# EAGLE design main_module (EAGLE 9.6.2)

## Sheet 1 of 2
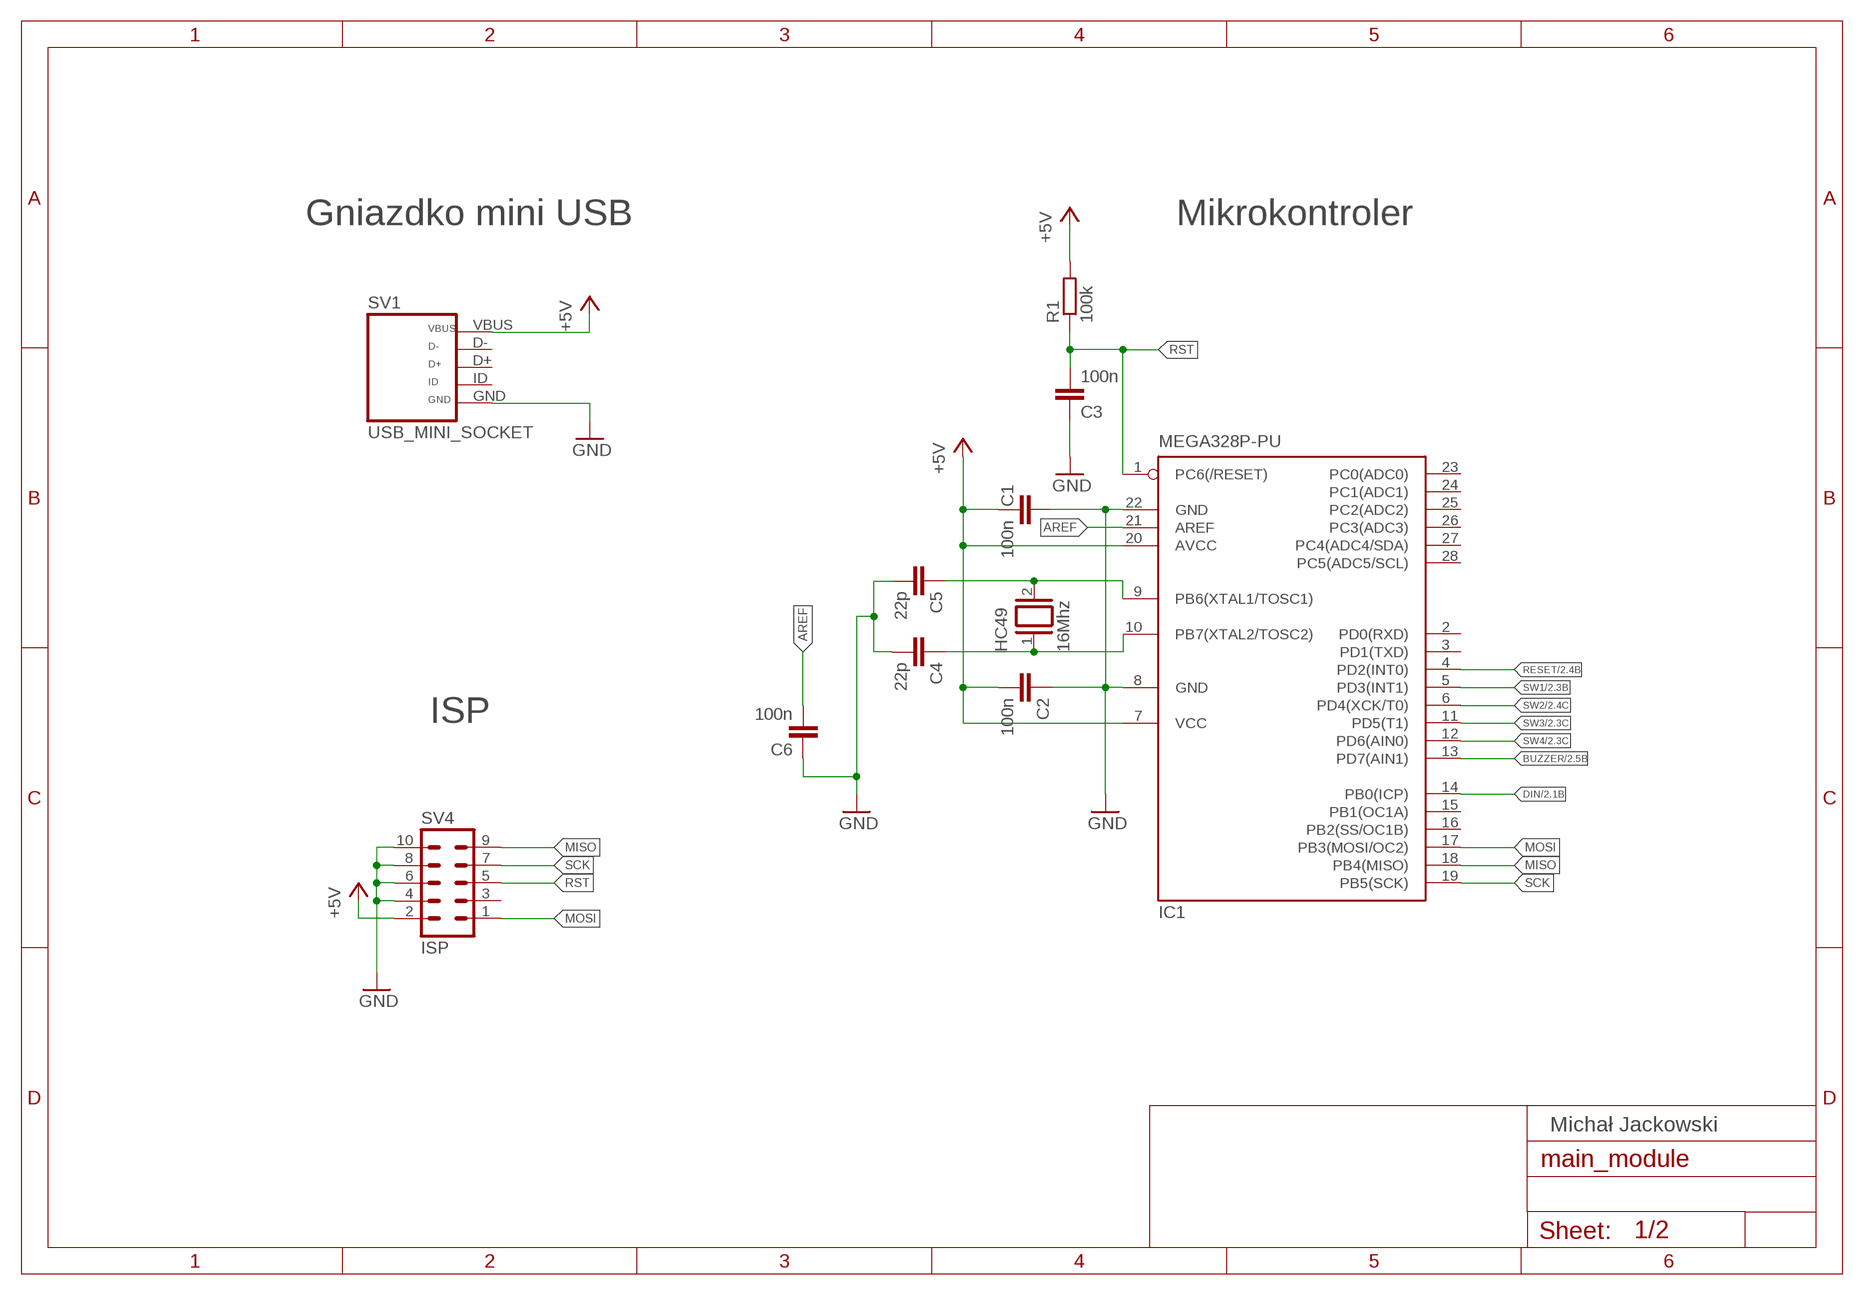
[diagram p0: schematic, sheet 1]

### Parts
C1  100n  C-EU025-040X050  [C025-040X050]
C2  100n  C-EU025-040X050  [C025-040X050]
C3  100n  C-EU025-040X050  [C025-040X050]
C4  22p  C-EU025-040X050  [C025-040X050]
C5  22p  C-EU025-040X050  [C025-040X050]
C6  100n  C-EU025-040X050  [C025-040X050]
IC1  MEGA328P-PU  [DIL28-3]
Q1  16Mhz  XTAL  [Q]
R1  100k  R-EU_0204/7  [0204/7]
SV1  USB_MINI_SOCKET  USB_MINI_SOCKETGNIAZDO5PINFE  [FE05-1]
SV4  ISP  ML10L  [ML10L]

### Nets
+5V: C1.2 C2.2 IC1.7(VCC) IC1.20(AVCC) R1.2 SV1.VBUS SV4.2 ; also sheet 2
AREF: C6.2 IC1.21(AREF)
BUZZER: IC1.13(PD7(AIN1)) ; also sheet 2
DIN: IC1.14(PB0(ICP)) ; also sheet 2
GND: C1.1 C2.1 C3.1 C4.2 C5.2 C6.1 IC1.8(GND) IC1.22(GND) SV1.GND SV4.4 SV4.6 SV4.8 SV4.10 ; also sheet 2
MISO: IC1.18(PB4(MISO)) SV4.9
MOSI: IC1.17(PB3(MOSI/OC2)) SV4.1
N$1: C5.1 IC1.9(PB6(XTAL1/TOSC1)) Q1.2
N$2: C4.1 IC1.10(PB7(XTAL2/TOSC2)) Q1.1
RESET: IC1.4(PD2(INT0)) ; also sheet 2
RST: C3.2 IC1.1(PC6(/RESET)) R1.1 SV4.5
SCK: IC1.19(PB5(SCK)) SV4.7
SW1: IC1.5(PD3(INT1)) ; also sheet 2
SW2: IC1.6(PD4(XCK/T0)) ; also sheet 2
SW3: IC1.11(PD5(T1)) ; also sheet 2
SW4: IC1.12(PD6(AIN0)) ; also sheet 2
Unconnected: IC1.2(PD0(RXD)) IC1.3(PD1(TXD)) IC1.15(PB1(OC1A)) IC1.16(PB2(SS/OC1B)) IC1.23(PC0(ADC0)) IC1.24(PC1(ADC1)) IC1.25(PC2(ADC2)) IC1.26(PC3(ADC3)) IC1.27(PC4(ADC4/SDA)) IC1.28(PC5(ADC5/SCL)) SV1.D+ SV1.D- SV1.ID SV4.3

### Notes on the sheet
- Gniazdko mini USB | Mikrokontroler
- ISP
- Michał Jackowski

## Sheet 2 of 2
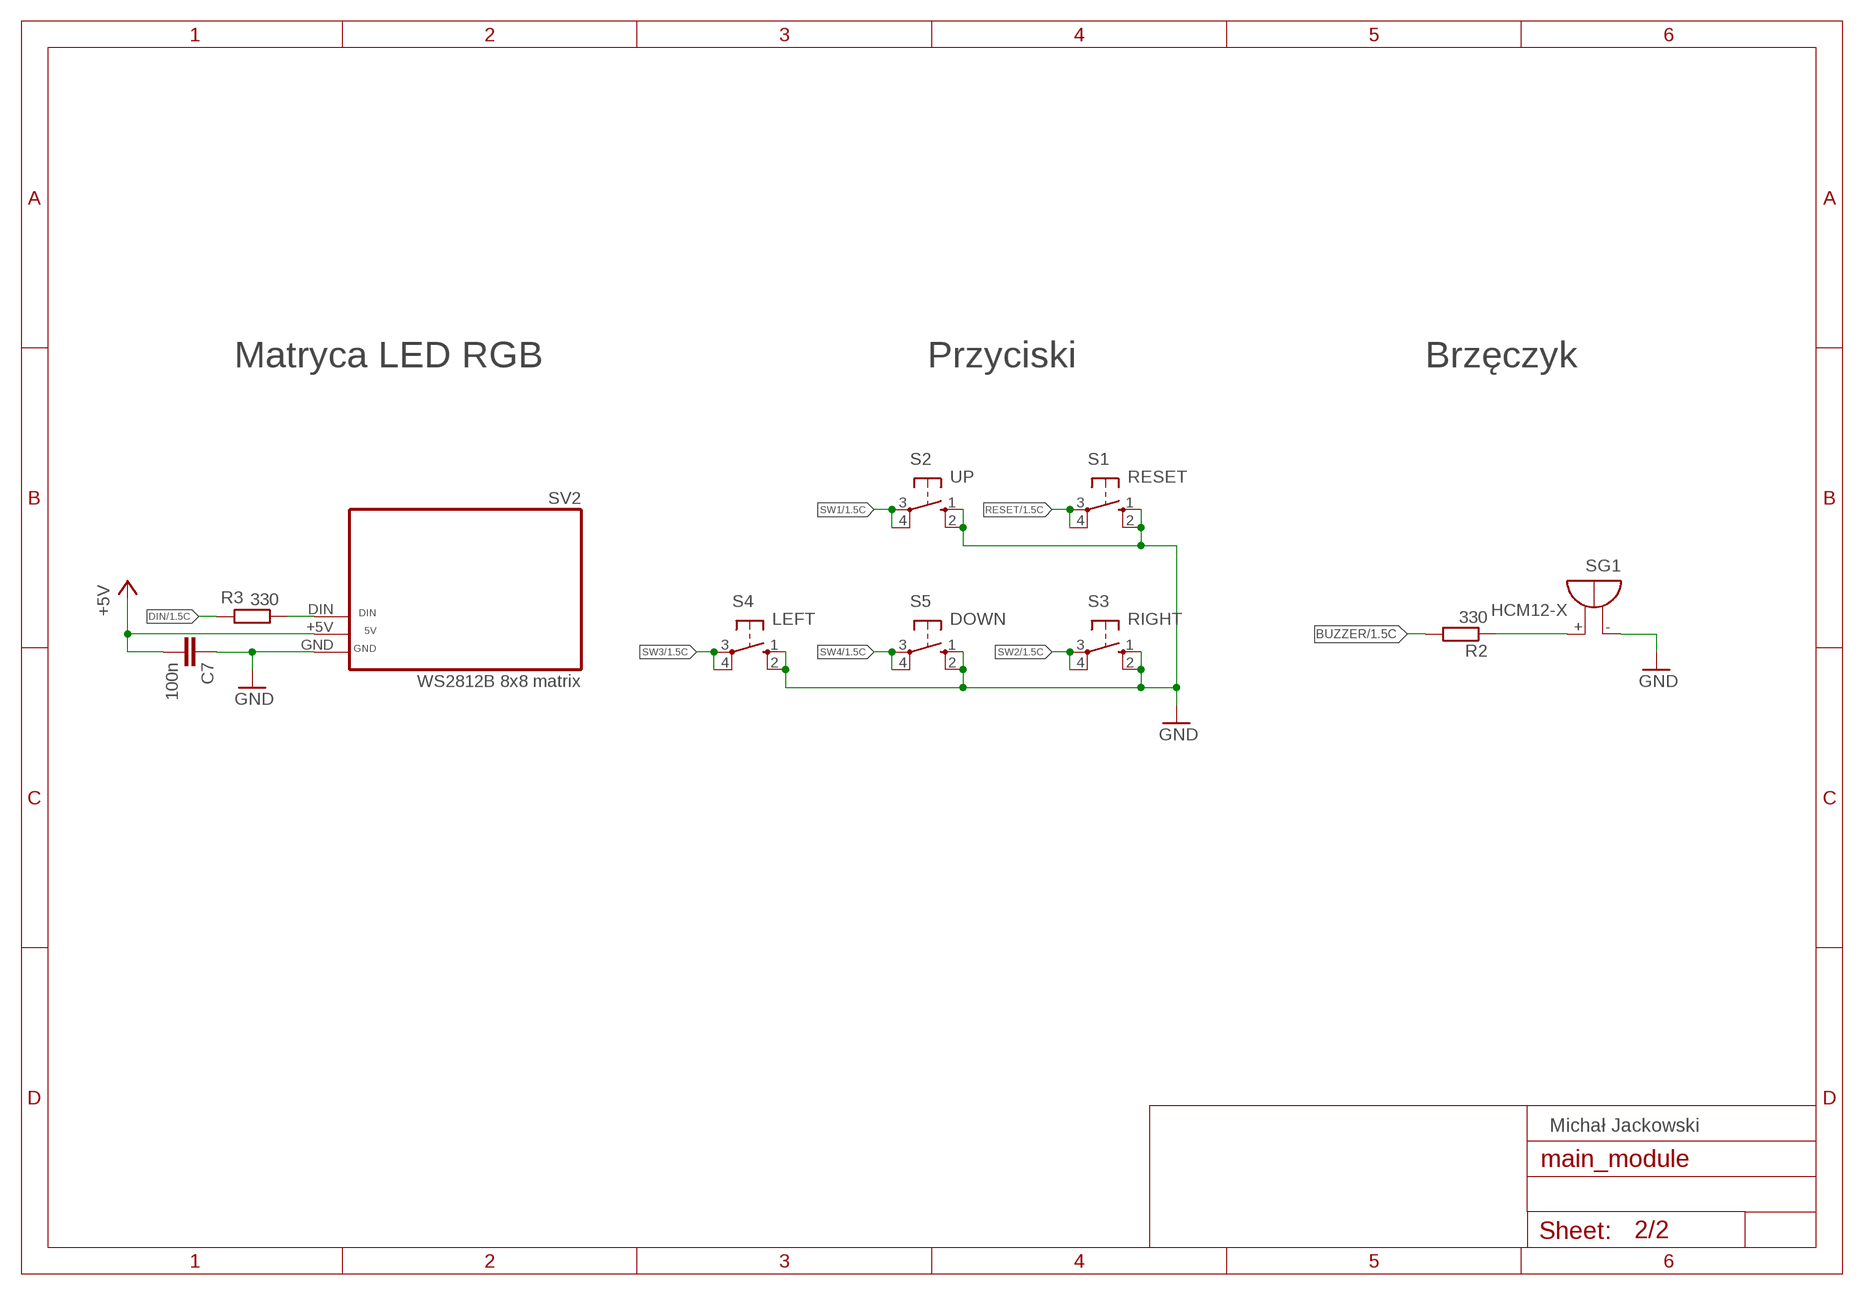
[diagram p1: schematic, sheet 2]

### Parts
C7  100n  C-EU025-040X050  [C025-040X050]
R2  330  R-EU_0204/7  [0204/7]
R3  330  R-EU_0204/7  [0204/7]
S1  RESET  40-XX  [B3F-40XX]
S2  UP  40-XX  [B3F-40XX]
S3  RIGHT  40-XX  [B3F-40XX]
S4  LEFT  40-XX  [B3F-40XX]
S5  DOWN  40-XX  [B3F-40XX]
SG1  HCM12-X  [F/QMBIII]
SV2  RGB_MATRIX_SOCKET  RGB_MATRIX_CONNECTOR  [MA03-1]

### Nets
+5V: C7.2 SV2.+5V(5V) ; also sheet 1
BUZZER: R2.2 ; also sheet 1
DIN: R3.2 ; also sheet 1
GND: C7.1 S1.1(S) S1.2(S1) S2.1(S) S2.2(S1) S3.1(S) S3.2(S1) S4.1(S) S4.2(S1) S5.1(S) S5.2(S1) SG1.-(+) SV2.GND ; also sheet 1
N$3: R2.1 SG1.+(-)
N$4: R3.1 SV2.DIN
RESET: S1.3(P) S1.4(P1) ; also sheet 1
SW1: S2.3(P) S2.4(P1) ; also sheet 1
SW2: S3.3(P) S3.4(P1) ; also sheet 1
SW3: S4.3(P) S4.4(P1) ; also sheet 1
SW4: S5.3(P) S5.4(P1) ; also sheet 1

### Notes on the sheet
- Matryca LED RGB | Przyciski | Brzęczyk
- Michał Jackowski

## Library data of the parts
C1-C7 = rcl:C-EU: CAPACITOR, European symbol; SPICEPREFIX: C
IC1 = Snake:MEGA328P-PU: MICROCONTROLLER 8 Kbytes FLASH, 1 kbytes SRAM, 512 bytes EEPROM, USART, 4-channel 10 bit ADC, 2-channel 8 bit ADC Pin compatible with Atmega48, ATMega88, ATMega168 Source: avr.lbr; OC_FARNELL: unknown; OC_NEWARK: unknown
Q1 = Snake:XTAL: CRYSTAL
R1-R3 = rcl:R-EU_: RESISTOR, European symbol; SPICEPREFIX: R
S1-S5 = Snake:40-XX: OMRON SWITCH; MF: OMRON COMPONENTS USA; MPN: B3F-4000; OC_FARNELL: 176434; OC_NEWARK: 36K3105
SG1 = Snake:HCM12-X: BUZZER Source: Buerklin; OC_FARNELL: unknown; OC_NEWARK: unknown
SV1 = Snake:USB_MINI_SOCKET: FEMALE HEADER
SV2 = Snake:RGB_MATRIX_CONNECTOR: PIN HEADER; OC_FARNELL: unknown; OC_NEWARK: unknown
SV4 = con-harting-ml:ML10: HARTING; OC_FARNELL: unknown; OC_NEWARK: unknown

## Board
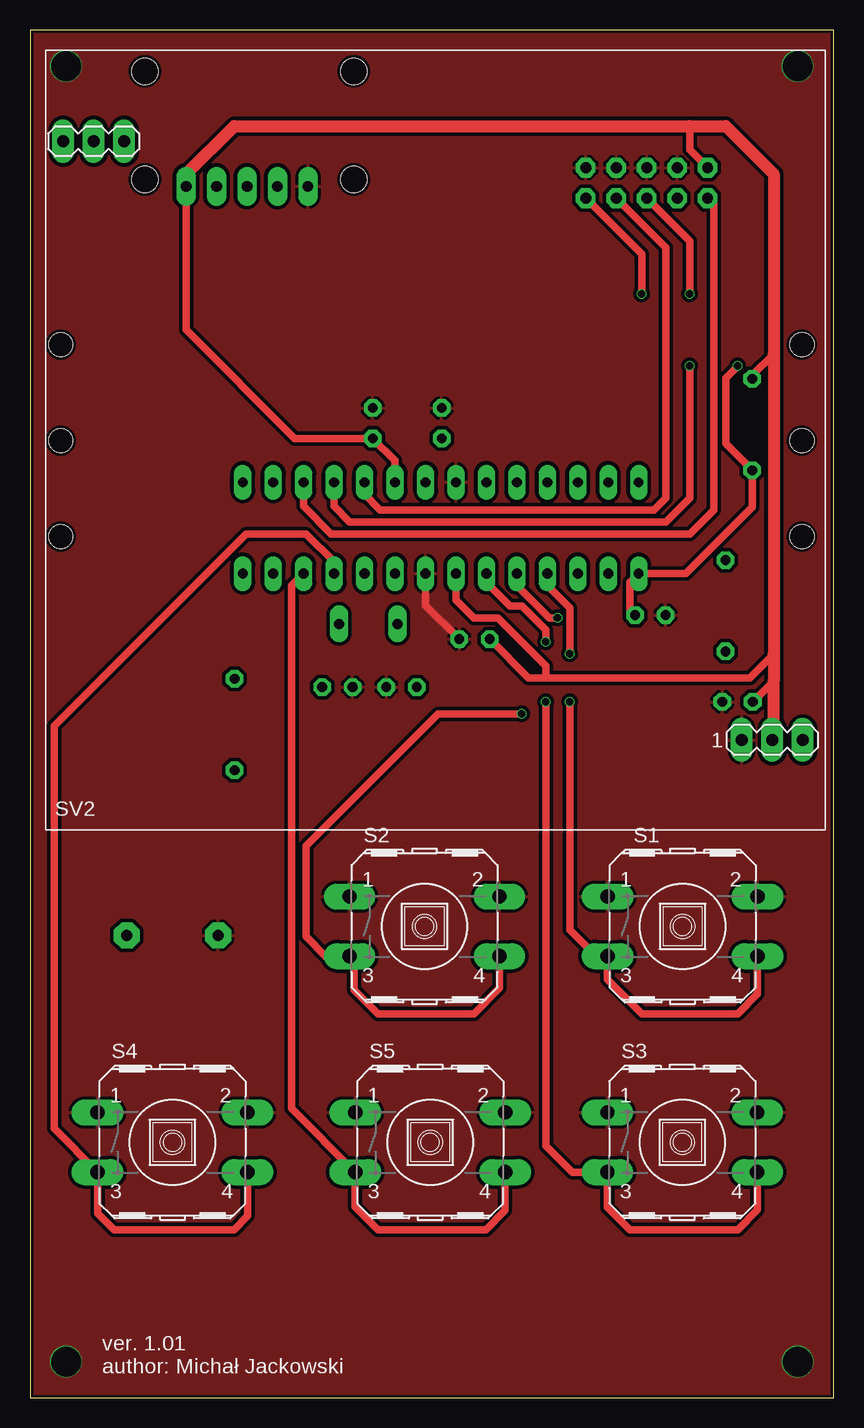
[diagram p2: board, top side]
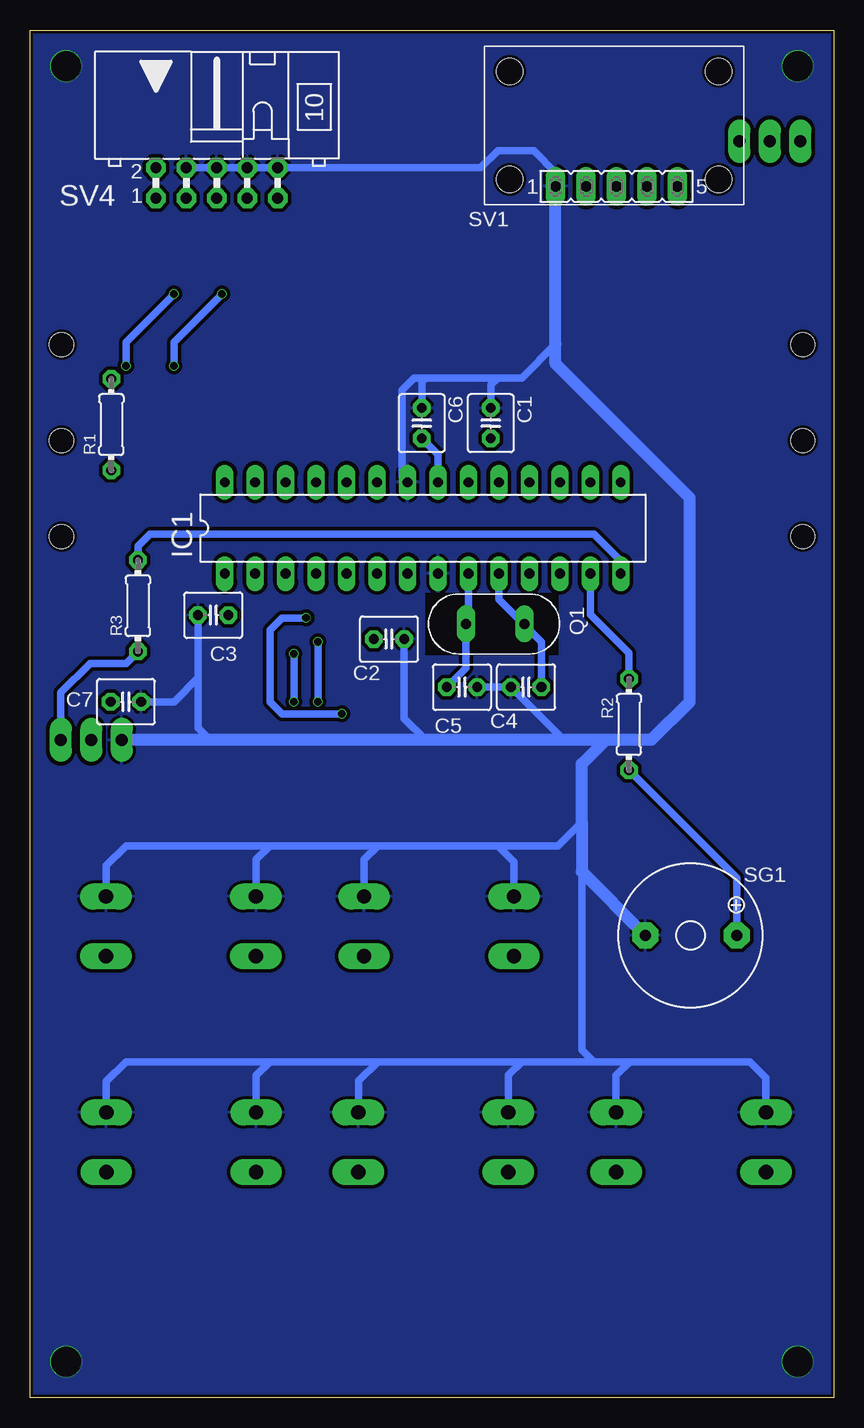
[diagram p3: board, bottom side, seen from below]

Size 67 x 114 mm. Coordinates in mm from the lower left corner, seen from the top.
Outline: 0,0 67,0 67,114 0,114 0,0
Copper layers (1*16): Top 0.035mm / dielectric 1.6mm / Bottom 0.035mm
Design rules "jlcpcb-2layers *": minimum track width 5mil, minimum drill 0.3mm, track to track 12mil, track to pad 12mil, pad to pad 12mil, via to via 12mil, smd to smd 12mil, copper to edge 0.2mm, drill to drill 6mil, minimum pad ring 10mil, minimum via ring 3mil, stop-mask expansion 4mil, vias tented up to drill 0mil, thermal gap 10mil

### Footprints (pad centres in the part's own frame; a part is rotated, then mirrored left to right if it is on the bottom)
C025-040X050 = drill 0.813 octagon: 1 -1.27,0; 2 1.27,0
DIL28-3 = drill 0.813 long: 1 -16.51,-3.81; 2 -13.97,-3.81; 3 -11.43,-3.81; 4 -8.89,-3.81; 5 -6.35,-3.81; 6 -3.81,-3.81; 7 -1.27,-3.81; 8 1.27,-3.81; 9 3.81,-3.81; 10 6.35,-3.81; 11 8.89,-3.81; 12 11.43,-3.81; 13 13.97,-3.81; 14 16.51,-3.81; 15 16.51,3.81; 16 13.97,3.81; 17 11.43,3.81; 18 8.89,3.81; 19 6.35,3.81; 20 3.81,3.81; 21 1.27,3.81; 22 -1.27,3.81; 23 -3.81,3.81; 24 -6.35,3.81; 25 -8.89,3.81; 26 -11.43,3.81; 27 -13.97,3.81; 28 -16.51,3.81
Q = drill 0.85 long: 1 0,0; 2 4.88,0
0204/7 = drill 0.813 octagon: 1 -3.81,0; 2 3.81,0
B3F-40XX = drill 1.194 long: 1 -6.248,2.489; 2 6.248,2.489; 3 -6.248,-2.489; 4 6.248,-2.489
F/QMBIII = drill 0.914 pad 2.159 octagon: + 3.851,0; - -3.751,0
FE05-1 = drill 0.9 long: D+ 10.998,1.524; D- 13.538,1.524; GND 5.918,1.524; ID 8.458,1.524; VBUS 16.078,1.524 | hole 2.184: 2.092,2.092; 2.092,11.116; 19.498,11.116; 19.498,2.092
MA03-1 = drill 1.016 long: +5V 60.62,7.55; +5VOUT 4.04,57.46; DIN 63.16,7.55; DOUT 1.5,57.46; GND 58.08,7.55; GNDOUT 6.58,57.46 | hole 2: 1.3,32.5; 63.1,32.5; 63.1,24.5; 63.1,40.5; 1.3,40.5; 1.3,24.5
ML10L = drill 0.914 octagon: 1 -5.08,-1.27; 2 -5.08,1.27; 3 -2.54,-1.27; 4 -2.54,1.27; 5 0,-1.27; 6 0,1.27; 7 2.54,-1.27; 8 2.54,1.27; 9 5.08,-1.27; 10 5.08,1.27

### Placement (x,y rotation side)
C1  28.58,81.22 270 bottom
C2  37.07,63.22 180 bottom
C3  51.72,65.22 0 bottom
C4  25.63,59.22 180 bottom
C5  30.98,59.22 0 bottom
C6  34.33,81.22 270 bottom
C7  59,58 180 bottom
IC1  34.25,72.49 0 bottom
Q1  25.77,64.49 180 bottom
R1  60.22,81.11 90 bottom
R2  17.06,56.11 90 bottom
R3  58,66 90 bottom
S1  54.41,39.28 0 top
S2  32.9,39.28 0 top
S3  54.39,21.28 0 top
S4  11.88,21.28 0 top
S5  33.37,21.28 0 top
SG1  11.93,38.52 0 bottom
SV1  29.09,99.44 0 bottom
SV2  1.27,47.27 0 top
SV4  51.42,101.25 0 bottom

### Tracks (layer width: path | path; a pad name or v marks a point on that pad's centre or on a via)
+5V
  Top 0.61: SV1.VBUS 13.01,89.01 22.07,79.95 C1.2 30.44,78.09 IC1.20 | 62,87 60.22,85.22 R1.2 | SV2.+5V 62,54.93 | 62,62 60,60 43,60 | 43,60 41.56,60 C2.2 | 62,59.73 C7.2 | 55,106 55,104.02 SV4.2 | IC1.7 35.52,66.48 37,65 39,65 43,61 43,60
  Top 1.016: 62,54.93 62,59.73 62,62 62,87 62,102 58,106 55,106 17.05,106 13.01,101.96 SV1.VBUS
AREF
  Bottom 0.61: IC1.21 32.98,78.6 C6.2
BUZZER
  Bottom 0.61: IC1.13 20.28,65.28 17.06,62.06 R2.2
DIN
  Bottom 0.61: IC1.14 17.74,69.74 20,72 57,72 58,71 R3.2
GND  (via drill 2.5)
  Top 0.61: IC1.8 32.98,66.04 C2.1
  Bottom 0.61: SV1.GND 23.17,102.12 25,103.94 28,103.94 29.42,102.52 SV4.10 SV4.8 SV4.6 SV4.4 | S4.1 5.63,26.63 7,28 17,28 | S4.2 18.13,26.87 17,28 | 17,28 20,28 | 20,28 26,28 | 26,28 38,28 | 38,28 47,28 | 47,28 59,28 60.64,26.36 S3.2 | S2.1 26.65,44.65 28,46 | 38,46 28,46 | S2.2 39.15,44.85 38,46 | 22.5,54.82 C4.2 C5.2 | 28,85 26,85 23.17,87.83 | 28,85 34,85 | C1.1 28.58,84.42 28,85 | C6.1 34.33,84.67 34,85 | C3.1 52.99,60.01 | 52.99,60.01 55,58 C7.1 | 34,85 35,85 36,84 36,76.78 IC1.22 | 34,54.82 35.8,56.62 C2.1 | 38,46 47,46 | S1.1 48.16,44.84 47,46 | 47,46 59,46 60.66,44.34 S1.2 | S5.1 27.12,26.88 26,28 | S3.1 48.14,26.86 47,28 | S5.2 39.62,26.38 38,28 | 28,46 23,46 21,48 | 21,43.84 21,29 20,28 | 52.99,60.01 52.99,55.81 52,54.82
  Bottom 1.016: SV1.GND 23.17,87.83 23.17,86.17 12,75 12,58 15.18,54.82 19,54.82 | SV2.GND 52,54.82 34,54.82 22.5,54.82 19,54.82 | SG1.- 21,43.84 21,48 21,52.82 19,54.82
  other vias: 3,111 64,111 3,3 64,3
  pour Bottom (isolate 0.254): 0,114 67,114 67,0 0,0
  pour Top (isolate 0.254): 0,114 67,114 67,0 0,0
  cutout Bottom: 23,67 34,67 34,62 23,62
MISO  (via drill 0.65)
  Top 0.61: IC1.18 25.36,74.3 26.66,73 53,73 55,75 v55,86 | SV4.9 51,95.32 v51,92
  Bottom 0.61: v51,92 55,88 v55,86
MOSI
  Top 0.61: IC1.17 22.82,74.3 25.12,72 55,72 57,74 57,99.48 SV4.1
N$1
  Bottom 0.61: IC1.9 30.44,64.7 Q1.2 30.65,60.82 C5.1
N$2
  Bottom 0.61: IC1.10 27.9,66.54 25.77,64.41 | 25.77,64.41 24.36,63 C4.1 | 25.77,64.41 Q1.1
N$3
  Bottom 0.61: R2.1 8.08,43.32 SG1.+
N$4
  Bottom 0.61: R3.1 59,61.19 62,61.19 64.43,58.76 SV2.DIN
RESET  (via drill 0.65)
  Top 0.61: IC1.4 43.14,67.68 45,65.82 v45,62 | v45,58 45,39 47.21,36.79 S1.3 48.16,34.84 51,32 59,32 60.66,33.66 S1.4
  Bottom 0.61: v45,62 v45,58
RST  (via drill 0.65)
  Top 0.61: C3.2 50,65.67 50,68 50.08,68 IC1.1 54.68,68.68 60.22,74.22 R1.1 58,79.52 58,85 v59,86 | SV4.5 55,96.4 v55,92
  Bottom 0.61: v55,92 59,88 v59,86
SCK
  Top 0.61: IC1.19 27.9,75.3 29.2,74 52,74 53,75 53,95.86 SV4.7
SW1  (via drill 0.65)
  Top 0.61: S2.4 39.15,34.15 37,32 29,32 27,34 27,36.44 S2.3 24.65,36.79 23,38.44 23,46 34,57 v41,57 | IC1.5 40.6,67.69 43.29,65 v43.99,65
  Bottom 0.61: v43.99,65 46,65 47,64 47,58 45.99,56.99 42.58,56.99 42.57,57 v41,57
SW2  (via drill 0.65)
  Top 0.61: v43,58 43,21 45.21,18.79 S3.3 48.14,15.86 50,14 59,14 60.64,15.64 S3.4 | IC1.6 38.06,67.94 40,66 41,66 43,64 v43,63
  Bottom 0.61: v43,63 v43,58
SW3
  Top 0.61: IC1.11 25.36,69.68 23.04,72 18,72 2,56 2,22.42 S4.3 5.63,15.37 7,14 17,14 18.13,15.13 S4.4
SW4
  Top 0.61: IC1.12 21.82,67.68 21.82,24.09 S5.3 27.12,15.88 29,14 38,14 39.62,15.62 S5.4

### Text on the board
tNames: ver. 1.01 / author: Michał Jackowski